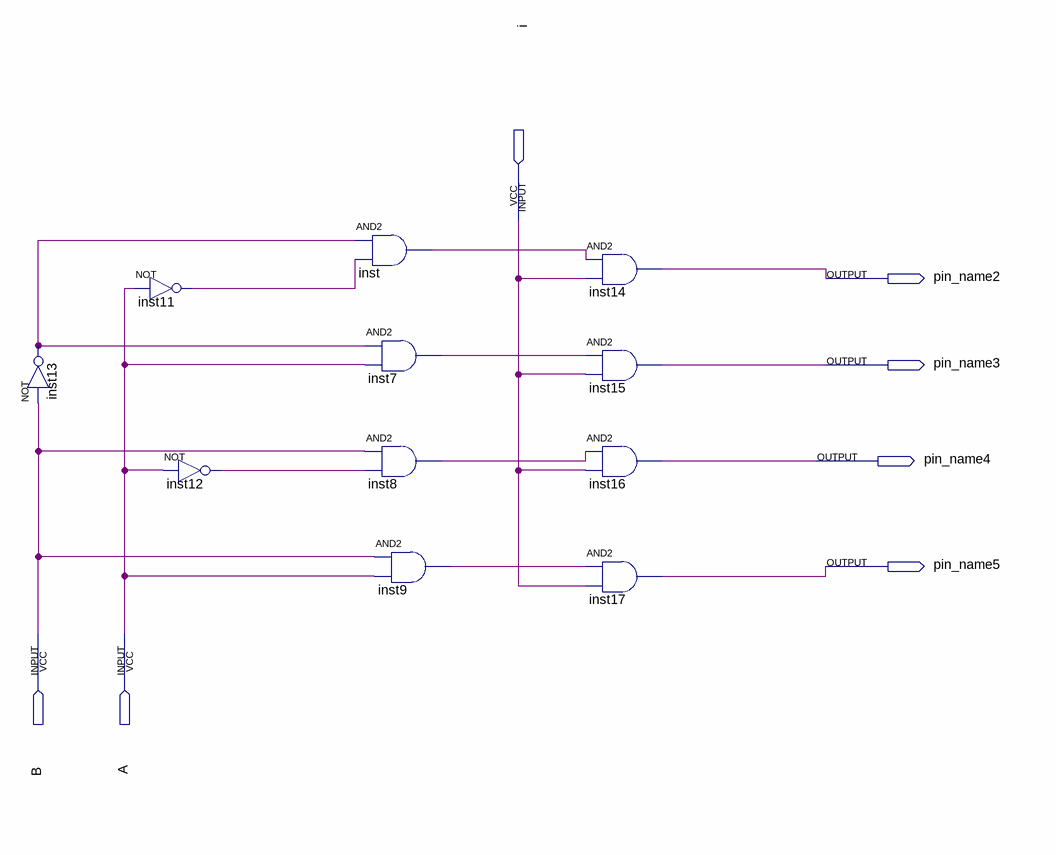
[diagram p0: schematic sheet]
// Quartus schematic lab02_4.bdf as structural Verilog: 11 symbols, 7 pins
module lab02_4 (
  input  i,
  input  B,
  input  A,
  output pin_name2,
  output pin_name3,
  output pin_name4,
  output pin_name5
);

  wire inst7_out, inst8_out, inst9_out, inst11_out, inst12_out, inst13_out, inst_out;

  not inst13 (inst13_out, B);
  not inst11 (inst11_out, A);
  not inst12 (inst12_out, A);
  and inst (inst_out, inst13_out, inst11_out);
  and inst7 (inst7_out, inst13_out, A);
  and inst8 (inst8_out, B, inst12_out);
  and inst9 (inst9_out, B, A);
  and inst14 (pin_name2, inst_out, i);
  and inst15 (pin_name3, inst7_out, i);
  and inst16 (pin_name4, inst8_out, i);
  and inst17 (pin_name5, inst9_out, i);
endmodule
